# Altium schematic sheet 1_USB_HUB.schdoc
size 1145 x 812 mm; Symbol: Altium_A0; Device: Altium_A0
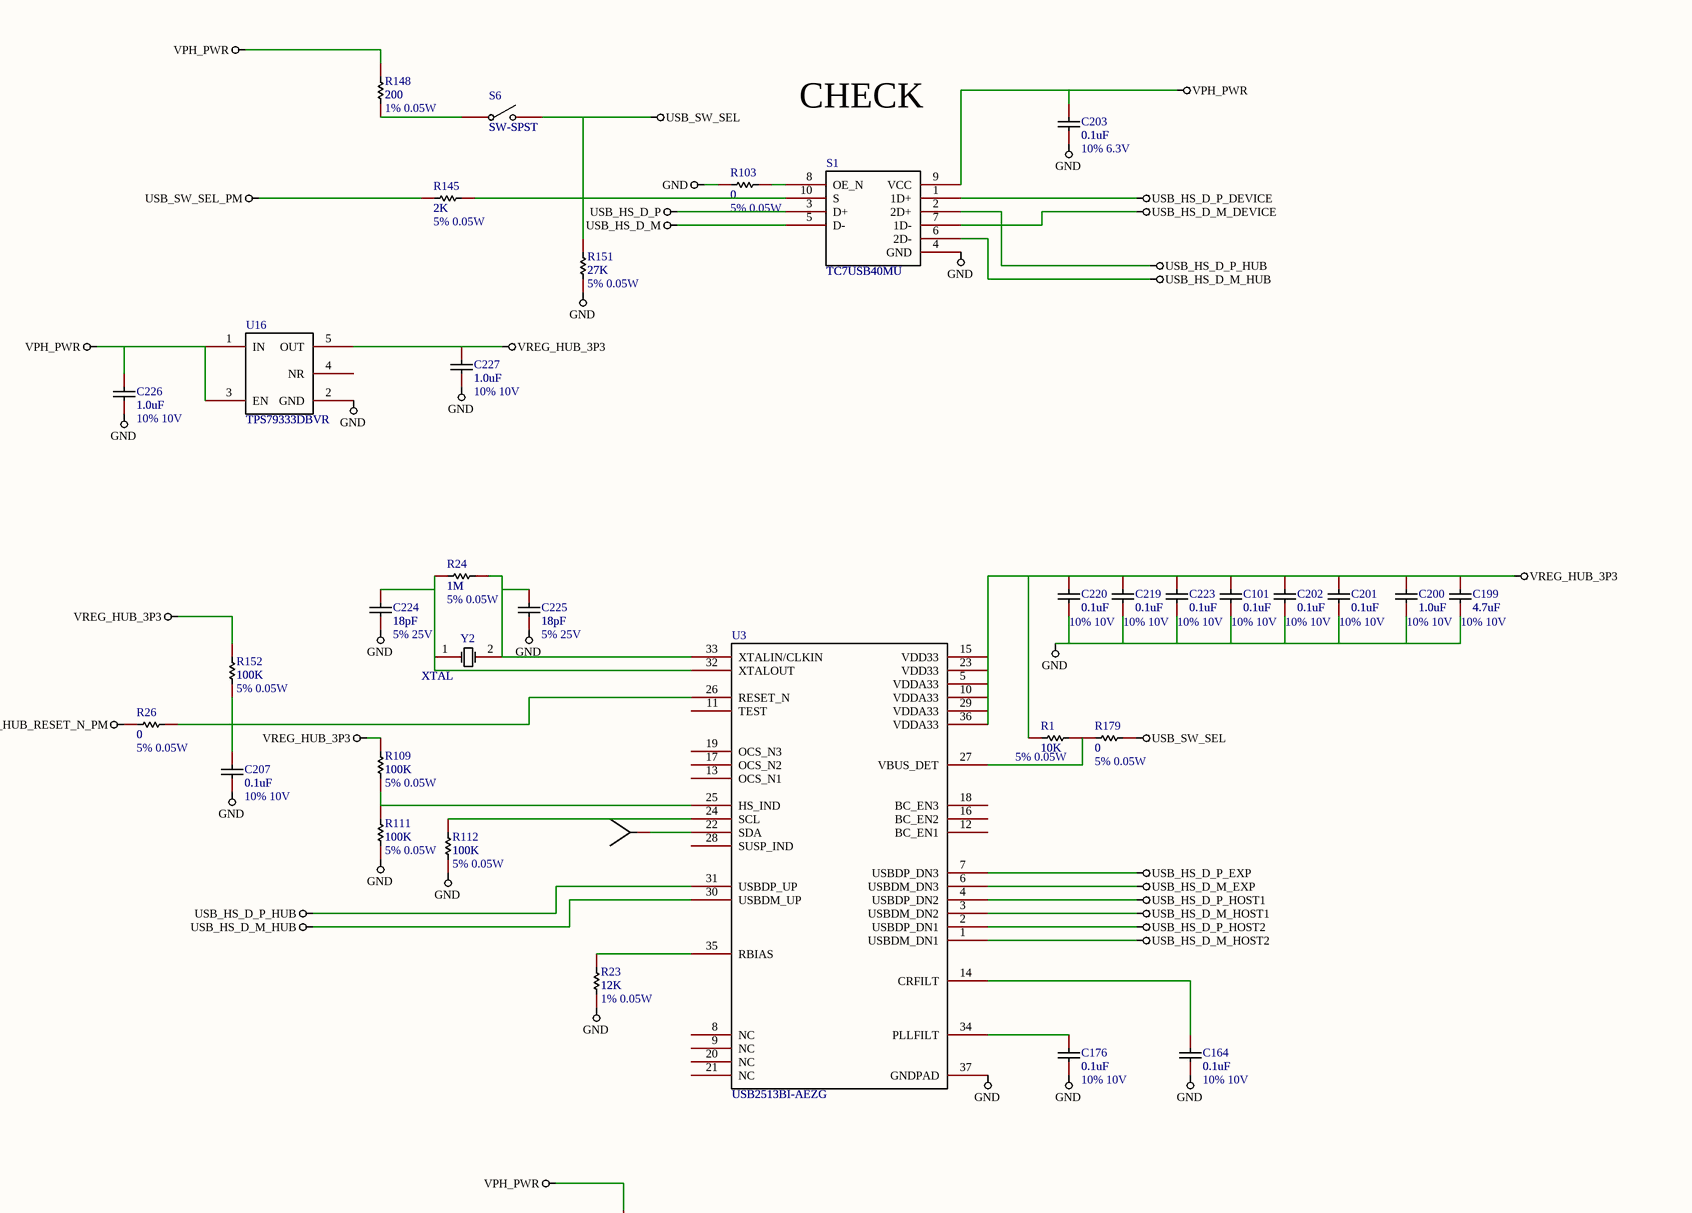
[diagram p0: 1_USB_HUB.schdoc, top left]
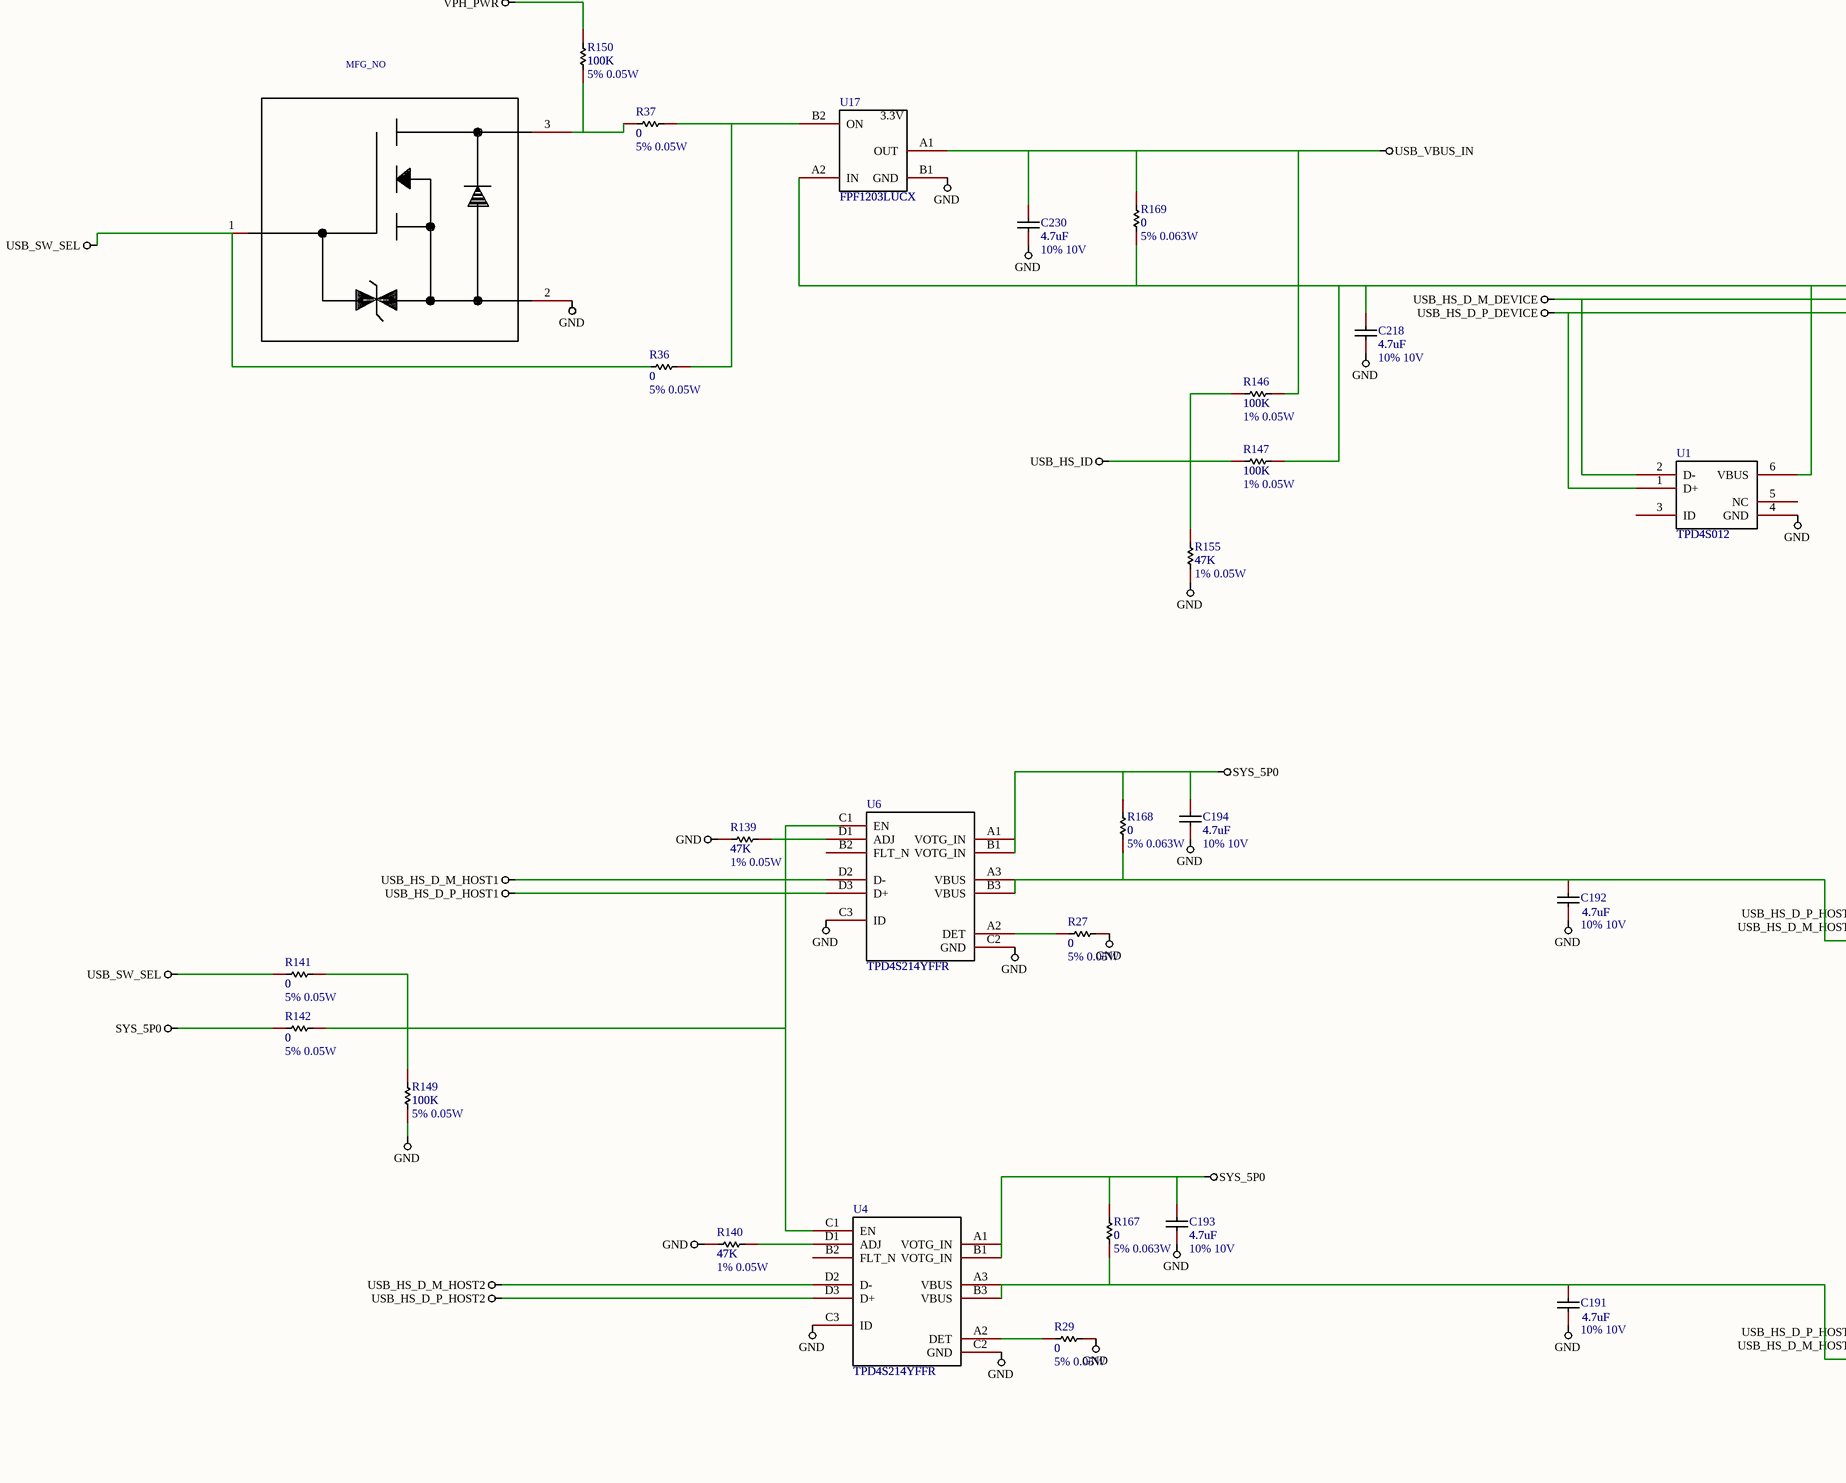
[diagram p1: 1_USB_HUB.schdoc, bottom left]
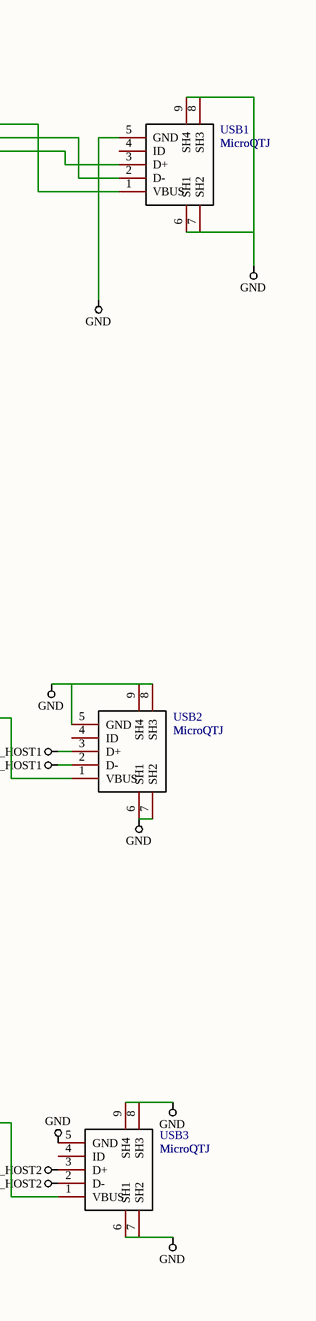
[diagram p2: 1_USB_HUB.schdoc, bottom right]

## Parts
C101  0.1uF  value 10% 10V
C164  0.1uF  value 10% 10V
C176  0.1uF  value 10% 10V
C191  4.7uF  value 10% 10V
C192  4.7uF  value 10% 10V
C193  4.7uF  value 10% 10V
C194  4.7uF  value 10% 10V
C199  4.7uF  value 10% 10V
C200  1.0uF  value 10% 10V
C201  0.1uF  value 10% 10V
C202  0.1uF  value 10% 10V
C203  0.1uF  value 10% 6.3V
C207  0.1uF  value 10% 10V
C218  4.7uF  value 10% 10V
C219  0.1uF  value 10% 10V
C220  0.1uF  value 10% 10V
C223  0.1uF  value 10% 10V
C224  18pF  value 5% 25V
C225  18pF  value 5% 25V
C226  1.0uF  value 10% 10V
C227  1.0uF  value 10% 10V
C230  4.7uF  value 10% 10V
Q1  PART_ID: MFG_NO  (hidden comment: nfet_zener_bidir)
R1  10K  value 5% 0.05W
R23  12K  value 1% 0.05W
R24  1M  value 5% 0.05W
R26  0  value 5% 0.05W
R27  0  value 5% 0.05W
R29  0  value 5% 0.05W
R36  0  value 5% 0.05W
R37  0  value 5% 0.05W
R103  0  value 5% 0.05W
R109  100K  value 5% 0.05W
R111  100K  value 5% 0.05W
R112  100K  value 5% 0.05W
R139  47K  value 1% 0.05W
R140  47K  value 1% 0.05W
R141  0  value 5% 0.05W
R142  0  value 5% 0.05W
R145  2K  value 5% 0.05W
R146  100K  value 1% 0.05W
R147  100K  value 1% 0.05W
R148  200  value 1% 0.05W
R149  100K  value 5% 0.05W
R150  100K  value 5% 0.05W
R151  27K  value 5% 0.05W
R152  100K  value 5% 0.05W
R155  47K  value 1% 0.05W
R167  0  value 5% 0.063W
R168  0  value 5% 0.063W
R169  0  value 5% 0.063W
R179  0  value 5% 0.05W
S1  TC7USB40MU
S6  SW-SPST
TP18  TP  (value not drawn)
U1  TPD4S012
U3  USB2513BI-AEZG
U4  TPD4S214YFFR
U6  TPD4S214YFFR
U16  TPS79333DBVR
U17  FPF1203LUCX
USB1  MicroQTJ  [MICRO-USB-SMD_MICROQTJ]
USB2  MicroQTJ  [MICRO-USB-SMD_MICROQTJ]
USB3  MicroQTJ  [MICRO-USB-SMD_MICROQTJ]
Y2  XTAL

## Nets
GND: C101.1 C164.1 C176.1 C191.2 C192.2 C193.1 C194.1 C199.1 C200.1 C201.1 C202.1 C203.2 C207.1 C218.1 C219.1 C220.1 C223.1 C224.1 C225.1 C226.1 C227.1 C230.1 Q1.2(S) R23.1 R27.2 R29.2 R103.1 R111.1 R112.1 R139.1 R140.1 R149.1 R151.1 R155.1 S1.4(GND) U1.4(GND) U3.37(GNDPAD) U4.C2(GND) U4.C3(ID) U6.C2(GND) U6.C3(ID) U16.2(GND) U17.B1(GND) USB1.5(GND) USB1.6(SH1) USB1.7(SH2) USB1.8(SH3) USB1.9(SH4) USB2.5(GND) USB2.6(SH1) USB2.7(SH2) USB2.8(SH3) USB2.9(SH4) USB3.5(GND) USB3.6(SH1) USB3.7(SH2) USB3.8(SH3) USB3.9(SH4)
SYS_5P0: C193.2 C194.2 R142.1 R167.2 R168.2 U4.A1(VOTG_IN) U4.B1(VOTG_IN) U6.A1(VOTG_IN) U6.B1(VOTG_IN)
USB_HS_D_M: S1.5(D-)
USB_HS_D_M_DEVICE: S1.7(1D-) U1.2(D-) USB1.2(D-)
USB_HS_D_M_EXP: U3.6(USBDM_DN3)
USB_HS_D_M_HOST1: U3.3(USBDM_DN2) U6.D2(D-) USB2.2(D-)
USB_HS_D_M_HOST2: U3.1(USBDM_DN1) U4.D2(D-) USB3.2(D-)
USB_HS_D_M_HUB: S1.6(2D-) U3.30(USBDM_UP)
USB_HS_D_P: S1.3(D+)
USB_HS_D_P_DEVICE: S1.1(1D+) U1.1(D+) USB1.3(D+)
USB_HS_D_P_EXP: U3.7(USBDP_DN3)
USB_HS_D_P_HOST1: U3.4(USBDP_DN2) U6.D3(D+) USB2.3(D+)
USB_HS_D_P_HOST2: U3.2(USBDP_DN1) U4.D3(D+) USB3.3(D+)
USB_HS_D_P_HUB: S1.2(2D+) U3.31(USBDP_UP)
USB_HS_ID: R146.1 R147.1 R155.2
USB_HUB_RESET_N_PM: R26.1
USB_SW_SEL: Q1.1(G) R36.1 R141.1 R145.2 R151.2 R179.1 S1.10(S) S6.2(NO)
USB_SW_SEL_PM: R145.1
USB_VBUS_IN: C230.2 R146.2 R169.2 U17.A1(OUT)
VPH_PWR: C203.1 C226.2 R148.2 R150.2 S1.9(VCC) U16.1(IN) U16.3(EN)
VREG_HUB_3P3: C101.2 C199.2 C200.2 C201.2 C202.2 C219.2 C220.2 C223.2 C227.2 R1.2 R109.2 R152.2 U3.5(VDDA33) U3.10(VDDA33) U3.15(VDD33) U3.23(VDD33) U3.29(VDDA33) U3.36(VDDA33) U16.5(OUT)
NetC164_2: C164.2 U3.14(CRFILT)
NetC176_2: C176.2 U3.34(PLLFILT)
NetC191_1: C191.1 R167.1 U4.A3(VBUS) U4.B3(VBUS) USB3.1(VBUS)
NetC192_1: C192.1 R168.1 U6.A3(VBUS) U6.B3(VBUS) USB2.1(VBUS)
NetC207_2: C207.2 R26.2 R152.1 U3.26(RESET_N)
NetC218_2: C218.2 R147.2 R169.1 U1.6(VBUS) U17.A2(IN) USB1.1(VBUS)
NetC224_2: C224.2 R24.1 U3.32(XTALOUT) Y2.1(OSC1)
NetC225_2: C225.2 R24.2 U3.33(XTALIN/CLKIN) Y2.2(OSC2)
NetQ1_3: Q1.3(D) R37.1 R150.1
NetR1_1: R1.1 R179.2 U3.27(VBUS_DET)
NetR23_2: R23.2 U3.35(RBIAS)
NetR27_1: R27.1 U6.A2(DET)
NetR29_1: R29.1 U4.A2(DET)
NetR36_2: R36.2 R37.2 U17.B2(ON)
NetR103_2: R103.2 S1.8(OE_N)
NetR109_1: R109.1 R111.2 U3.25(HS_IND)
NetR112_2: R112.2 U3.24(SCL)
NetR139_2: R139.2 U6.D1(ADJ)
NetR140_2: R140.2 U4.D1(ADJ)
NetR141_2: R141.2 R142.2 R149.2 U4.C1(EN) U6.C1(EN)
NetR148_1: R148.1 S6.1(COMMON)
NetTP18_1: TP18.1(IO1) U3.22(SDA)

Not connected (* = marked no-connect by the designer): U1 3(ID) 5(NC); U3 8(NC) 9(NC) 11(TEST) 12(BC_EN1) 13(OCS_N1) 16(BC_EN2) 17(OCS_N2) 18(BC_EN3) 19(OCS_N3) 20(NC) 21(NC) 28(SUSP_IND); U4 B2(FLT_N); U6 B2(FLT_N); U16 4(NR); USB1 4(ID); USB2 4(ID); USB3 4(ID)

## Notes on the sheet
- CHECK
- 1
- 2
- 3
- 4
- 5
- 6
- A
- B
- C
- D
- Title
- Size
- A0
- Number
- Revision
- File:
- Date:
- Drawn By:
- Sheet
- Of
- (in symbol FPF1203LUCX) 3.3V

## Library data of the parts
C101 C164 C176 C201-C203 C207 C219 C220 C223 = 0.1uF: Capacitor; Symbol: Cap; Add into BOM: yes; Origin Footprint: RAD-0.3; Name: 0.1uF; Device: 0.1uF; Published: 8-Jun-2000; LatestRevisionDate: 17-Jul-2002; LatestRevisionNote: Re-released for DXP Platform.; PackageReference: RAD-0.3; Publisher: Altium Limited; PackageDescription: Radial Cap, Thru-Hole; 2 Leads; 0.3 in Pin Spacing; Convert to PCB: yes; Design Item ID: Cap; Library Name: Miscellaneous Devices
C191-C194 C199 C218 C230 = 4.7uF: Capacitor; Symbol: Cap; Add into BOM: yes; Origin Footprint: RAD-0.3; Name: 4.7uF; Device: 4.7uF; Published: 8-Jun-2000; LatestRevisionDate: 17-Jul-2002; LatestRevisionNote: Re-released for DXP Platform.; PackageReference: RAD-0.3; Publisher: Altium Limited; PackageDescription: Radial Cap, Thru-Hole; 2 Leads; 0.3 in Pin Spacing; Convert to PCB: yes; Design Item ID: Cap; Library Name: Miscellaneous Devices
C200 C226 C227 = 1.0uF: Capacitor; Symbol: Cap; Add into BOM: yes; Origin Footprint: RAD-0.3; Name: 1.0uF; Device: 1.0uF; Published: 8-Jun-2000; LatestRevisionDate: 17-Jul-2002; LatestRevisionNote: Re-released for DXP Platform.; PackageReference: RAD-0.3; Publisher: Altium Limited; PackageDescription: Radial Cap, Thru-Hole; 2 Leads; 0.3 in Pin Spacing; Convert to PCB: yes; Design Item ID: Cap; Library Name: Miscellaneous Devices
C224 C225 = 18pF: Capacitor; Symbol: Cap; Add into BOM: yes; Origin Footprint: RAD-0.3; Name: 18pF; Device: 18pF; Published: 8-Jun-2000; LatestRevisionDate: 17-Jul-2002; LatestRevisionNote: Re-released for DXP Platform.; PackageReference: RAD-0.3; Publisher: Altium Limited; PackageDescription: Radial Cap, Thru-Hole; 2 Leads; 0.3 in Pin Spacing; Convert to PCB: yes; Design Item ID: Cap; Library Name: Miscellaneous Devices
Q1 = nfet_zener_bidir: PART_NUMBER: MCN_NO; OriginalSymbolOrigin: (-525,450); CDS_LMAN_SYM_OUTLINE: -475,450,475,-450; Add into BOM: yes; Name: nfet_zener_bidir; Symbol: NFET_ZENER_BIDIR; Device: nfet_zener_bidir; SYMNAME: nfet_zener_bidir; PACK_TYPE: ?; Convert to PCB: yes; Origin Footprint: NFET_ZENER_BIDIR; Design Item ID: NFET_ZENER_BIDIR; Library Name: MSM8916_DRAM_PMIC_REF_Library
R1 = 10K: Resistor; Symbol: Res1; Add into BOM: yes; Origin Footprint: AXIAL-0.3; Name: 10K; Device: 10K; Published: 8-Jun-2000; LatestRevisionDate: 17-Jul-2002; LatestRevisionNote: Re-released for DXP Platform.; PackageReference: AXIAL-0.3; Publisher: Altium Limited; PackageDescription: Axial Device, Thru-Hole; 2 Leads; 0.3 in Pin Spacing; Convert to PCB: yes; Design Item ID: Res1; Library Name: Miscellaneous Devices
R23 = 12K: Resistor; Symbol: Res1; Add into BOM: yes; Origin Footprint: AXIAL-0.3; Name: 12K; Device: 12K; Published: 8-Jun-2000; LatestRevisionDate: 17-Jul-2002; LatestRevisionNote: Re-released for DXP Platform.; PackageReference: AXIAL-0.3; Publisher: Altium Limited; PackageDescription: Axial Device, Thru-Hole; 2 Leads; 0.3 in Pin Spacing; Convert to PCB: yes; Design Item ID: Res1; Library Name: Miscellaneous Devices
R24 = 1M: Resistor; Symbol: Res1; Add into BOM: yes; Origin Footprint: AXIAL-0.3; Name: 1M; Device: 1M; Published: 8-Jun-2000; LatestRevisionDate: 17-Jul-2002; LatestRevisionNote: Re-released for DXP Platform.; PackageReference: AXIAL-0.3; Publisher: Altium Limited; PackageDescription: Axial Device, Thru-Hole; 2 Leads; 0.3 in Pin Spacing; Convert to PCB: yes; Design Item ID: Res1; Library Name: Miscellaneous Devices
R26 R27 R29 R36 R37 R103 R141 R142 R167-R169 R179 = 0: Resistor; Symbol: Res1; Add into BOM: yes; Origin Footprint: AXIAL-0.3; Name: 0; Device: 0; Published: 8-Jun-2000; LatestRevisionDate: 17-Jul-2002; LatestRevisionNote: Re-released for DXP Platform.; PackageReference: AXIAL-0.3; Publisher: Altium Limited; PackageDescription: Axial Device, Thru-Hole; 2 Leads; 0.3 in Pin Spacing; Convert to PCB: yes; Design Item ID: Res1; Library Name: Miscellaneous Devices
R109 R111 R112 R146 R147 R149 R150 R152 = 100K: Resistor; Symbol: Res1; Add into BOM: yes; Origin Footprint: AXIAL-0.3; Name: 100K; Device: 100K; Published: 8-Jun-2000; LatestRevisionDate: 17-Jul-2002; LatestRevisionNote: Re-released for DXP Platform.; PackageReference: AXIAL-0.3; Publisher: Altium Limited; PackageDescription: Axial Device, Thru-Hole; 2 Leads; 0.3 in Pin Spacing; Convert to PCB: yes; Design Item ID: Res1; Library Name: Miscellaneous Devices
R139 R140 R155 = 47K: Resistor; Symbol: Res1; Add into BOM: yes; Origin Footprint: AXIAL-0.3; Name: 47K; Device: 47K; Published: 8-Jun-2000; LatestRevisionDate: 17-Jul-2002; LatestRevisionNote: Re-released for DXP Platform.; PackageReference: AXIAL-0.3; Publisher: Altium Limited; PackageDescription: Axial Device, Thru-Hole; 2 Leads; 0.3 in Pin Spacing; Convert to PCB: yes; Design Item ID: Res1; Library Name: Miscellaneous Devices
R145 = 2K: Resistor; Symbol: Res1; Add into BOM: yes; Origin Footprint: AXIAL-0.3; Name: 2K; Device: 2K; Published: 8-Jun-2000; LatestRevisionDate: 17-Jul-2002; LatestRevisionNote: Re-released for DXP Platform.; PackageReference: AXIAL-0.3; Publisher: Altium Limited; PackageDescription: Axial Device, Thru-Hole; 2 Leads; 0.3 in Pin Spacing; Convert to PCB: yes; Design Item ID: Res1; Library Name: Miscellaneous Devices
R148 = 200: Resistor; Symbol: Res1; Add into BOM: yes; Origin Footprint: AXIAL-0.3; Name: 200; Device: 200; Published: 8-Jun-2000; LatestRevisionDate: 17-Jul-2002; LatestRevisionNote: Re-released for DXP Platform.; PackageReference: AXIAL-0.3; Publisher: Altium Limited; PackageDescription: Axial Device, Thru-Hole; 2 Leads; 0.3 in Pin Spacing; Convert to PCB: yes; Design Item ID: Res1; Library Name: Miscellaneous Devices
R151 = 27K: Resistor; Symbol: Res1; Add into BOM: yes; Origin Footprint: AXIAL-0.3; Name: 27K; Device: 27K; Published: 8-Jun-2000; LatestRevisionDate: 17-Jul-2002; LatestRevisionNote: Re-released for DXP Platform.; PackageReference: AXIAL-0.3; Publisher: Altium Limited; PackageDescription: Axial Device, Thru-Hole; 2 Leads; 0.3 in Pin Spacing; Convert to PCB: yes; Design Item ID: Res1; Library Name: Miscellaneous Devices
S1 = TC7USB40MU: Add into BOM: yes; Name: TC7USB40MU; Symbol: TC7USB40MU; Device: TC7USB40MU; Convert to PCB: yes; Origin Footprint: TC7USB40MU; Design Item ID: TC7USB40MU; Library Name: MSM8916_DRAM_PMIC_REF_Library
S6 = SW-SPST: Single-Pole, Single-Throw Switch; Add into BOM: yes; Origin Footprint: SPST-2; Name: SW-SPST; Symbol: SW-SPST; Device: SW-SPST; Published: 24-Mar-1999; LatestRevisionDate: 17-Jul-2002; LatestRevisionNote: Re-released for DXP Platform.; PackageReference: SPST-2; Publisher: Altium Limited; PackageDescription: Switch; 2 Leads; Convert to PCB: yes; Design Item ID: SW-SPST; Library Name: Miscellaneous Devices
TP18 = TP: PART_NUMBER: MCN_NO; PART_ID: MFG_NO; Symbol: TP_Dup1; OriginalSymbolOrigin: (-50,75); CDS_LMAN_SYM_OUTLINE: -50,75,50,0; Add into BOM: yes; Name: TP; Device: TP; SYMNAME: TP; PACK_TYPE: TP; Convert to PCB: yes; Origin Footprint: TP_Dup1; Design Item ID: TP_Dup1; Library Name: MSM8916_DRAM_PMIC_REF_Library
U1 = TPD4S012: Add into BOM: yes; Name: TPD4S012; Symbol: TPD4S012; Device: TPD4S012; Convert to PCB: yes; Origin Footprint: TPD4S012; Design Item ID: TPD4S012; Library Name: MSM8916_DRAM_PMIC_REF_Library
U3 = USB2513BI-AEZG: Add into BOM: yes; Name: USB2513BI-AEZG; Symbol: USB2513BI-AEZG; Device: USB2513BI-AEZG; Convert to PCB: yes; Origin Footprint: USB2513BI-AEZG; Design Item ID: USB2513BI-AEZG; Library Name: MSM8916_DRAM_PMIC_REF_Library
U4 U6 = TPD4S214YFFR: Add into BOM: yes; Name: TPD4S214YFFR; Symbol: TPD4S214YFFR; Device: TPD4S214YFFR; Convert to PCB: yes; Origin Footprint: TPD4S214YFFR; Design Item ID: TPD4S214YFFR; Library Name: MSM8916_DRAM_PMIC_REF_Library
U16 = TPS79333DBVR: Add into BOM: yes; Name: TPS79333DBVR; Symbol: TPS79333DBVR; Device: TPS79333DBVR; Convert to PCB: yes; Origin Footprint: TPS79333DBVR; Design Item ID: TPS79333DBVR; Library Name: MSM8916_DRAM_PMIC_REF_Library
U17 = FPF1203LUCX: Add into BOM: yes; Name: FPF1203LUCX; Symbol: FPF1203LUCX; Device: FPF1203LUCX; Convert to PCB: yes; Origin Footprint: FPF1203LUCX; Design Item ID: FPF1203LUCX; Library Name: MSM8916_DRAM_PMIC_REF_Library
USB1-USB3 = MicroQTJ: 连接器类型:Micro-B;标准:USB 2.0;公母:母座;触点数量:5;端口数量:1;安装方式:卧贴;额定电流 - 电源:-;工作温度范围:-30℃~+80℃;; Manufacturer: SHOU HAN(首韩); Add into BOM: yes; Gender: 母座; Number of Contacts: 5; Number of Ports: 1; Name: MicroQTJ; Symbol: MICROQTJ; Device: MicroQTJ; LCSC Part Name: Micro-B 母座 卧贴 有柱; Supplier Part: C404968; Manufacturer Part: MicroQTJ; Supplier Footprint: SMD; JLCPCB Part Class: Extended Part; Datasheet: https://atta.szlcsc.com/upload/public/pdf/source/20191210/C404968_B20FD489995C34B84F95A25A4974802C.pdf; Supplier: LCSC; Convert to PCB: yes; Connector Type: Micro-B; Standard: USB 2.0; Mounting Style: 卧贴; Current Rating - Power (Max): -; Operating Temperature Range: -30℃~+80℃
Y2 = XTAL: Crystal Oscillator; Add into BOM: yes; Origin Footprint: R38; Name: XTAL; Symbol: XTAL; Device: XTAL; Published: 8-Jun-2000; LatestRevisionDate: 17-Jul-2002; LatestRevisionNote: Re-released for DXP Platform.; PackageReference: R38; Publisher: Altium Limited; PackageDescription: Crystal, Thru-Hole; 2 Leads; Body 3.1 x 8.2 mm (Dia.xH); Convert to PCB: yes; Design Item ID: XTAL; Library Name: Miscellaneous Devices